# EAGLE design addon-candle-2 (EAGLE 6.6.0)

## Sheet 1 of 4: CAN Transceiver
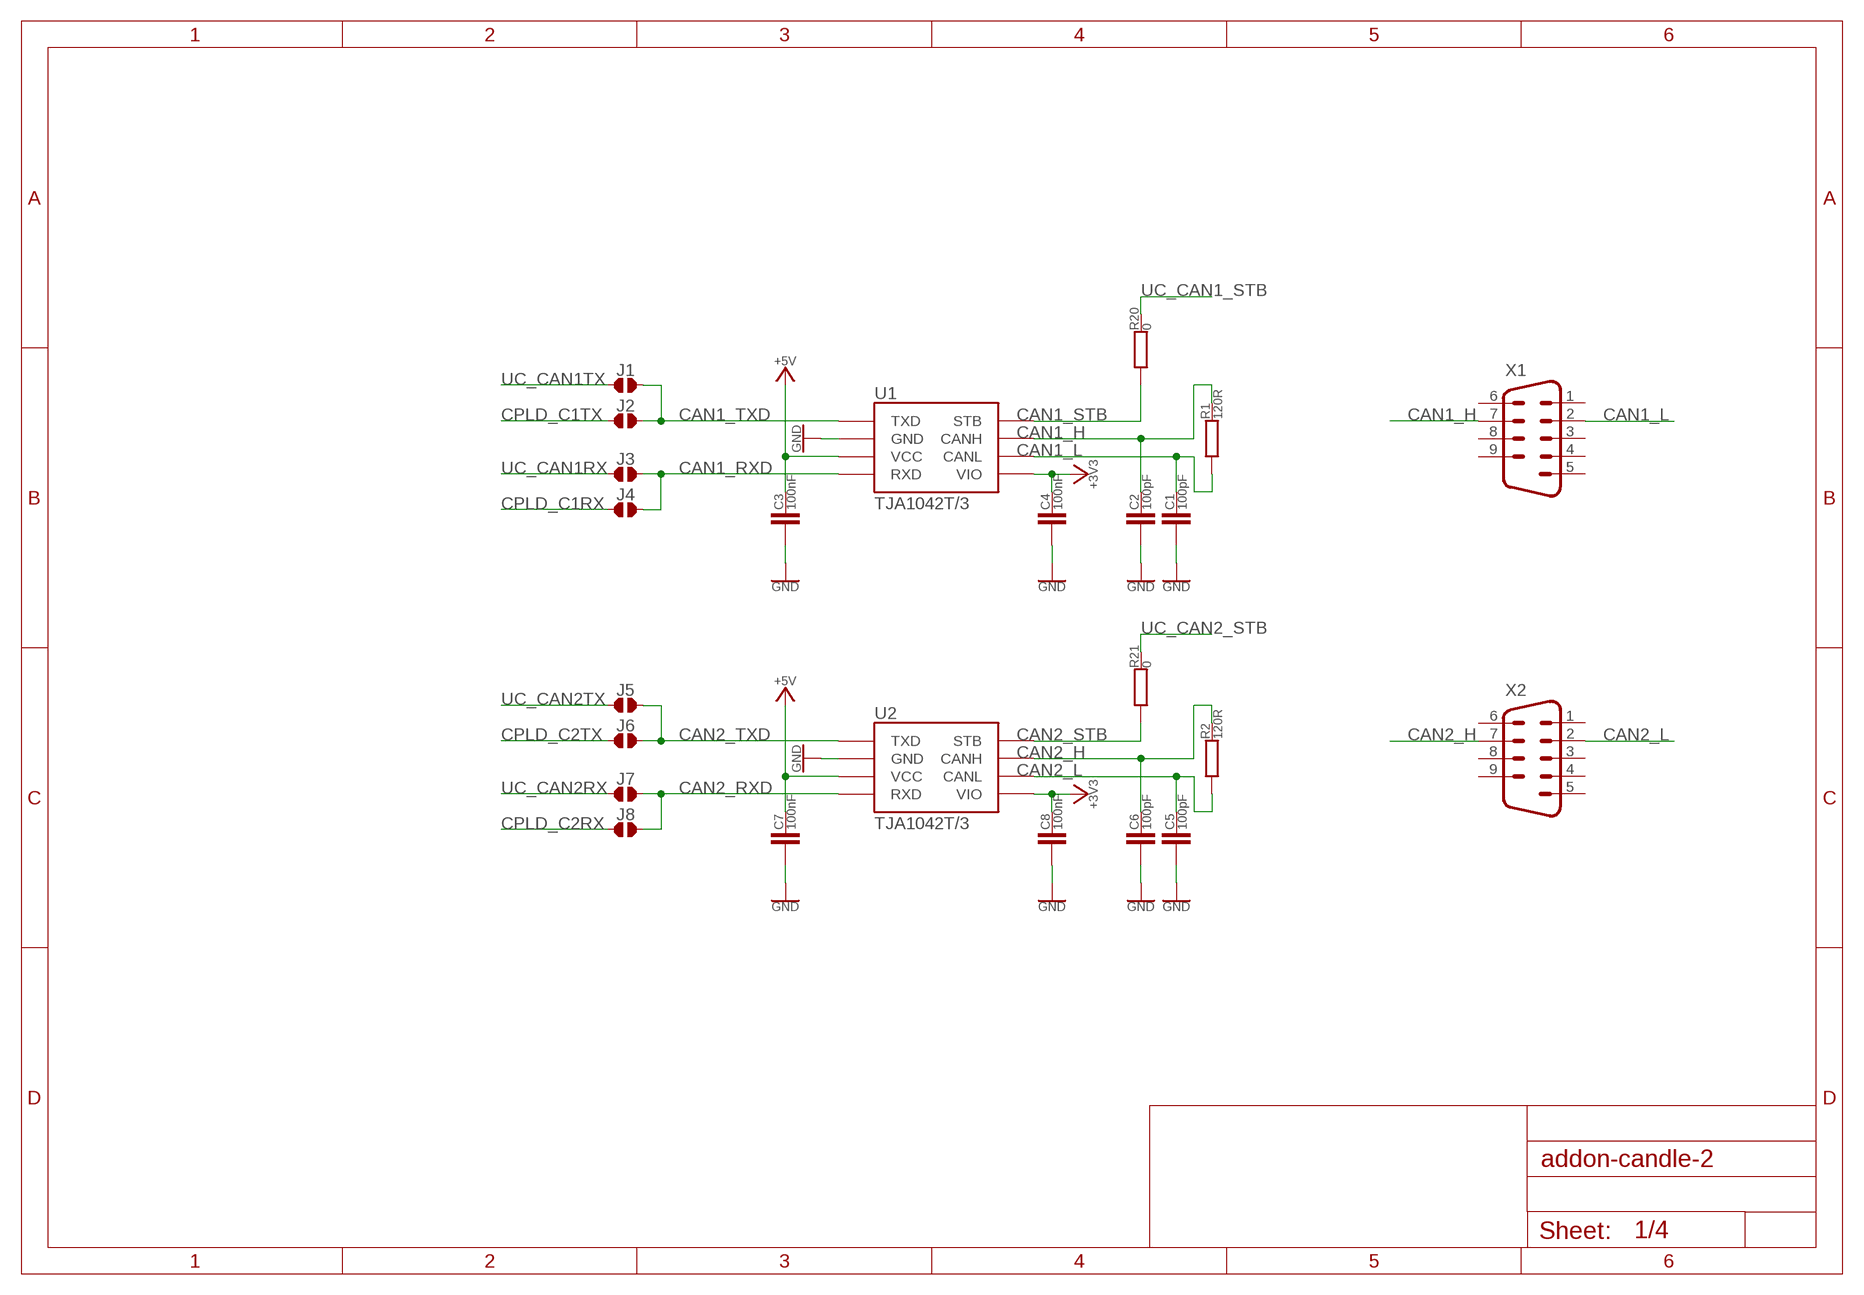
[diagram p0: schematic, sheet 1]

### Parts
C1  100pF  C0603  [C0603]
C2  100pF  C0603  [C0603]
C3  100nF  C0603  [C0603]
C4  100nF  C0603  [C0603]
C5  100pF  C0603  [C0603]
C6  100pF  C0603  [C0603]
C7  100nF  C0603  [C0603]
C8  100nF  C0603  [C0603]
J1  JUMPER-2_10B  [JMP2-1B]
J2  JUMPER-2_10B  [JMP2-1B]
J3  JUMPER-2_10B  [JMP2-1B]
J4  JUMPER-2_10B  [JMP2-1B]
J5  JUMPER-2_10B  [JMP2-1B]
J6  JUMPER-2_10B  [JMP2-1B]
J7  JUMPER-2_10B  [JMP2-1B]
J8  JUMPER-2_10B  [JMP2-1B]
R1  120R  R0603  [R0603]
R2  120R  R0603  [R0603]
R20  0  R0603  [R0603]
R21  0  R0603  [R0603]
U1  TJA1042T/3  [SO08]
U2  TJA1042T/3  [SO08]
X1  M09-182  [182-009-MALE]
X2  M09-182  [182-009-MALE]

### Nets
+3V3: C4.2 C8.2 U1.5(VIO) U2.5(VIO) ; also sheet 2,3,4
+5V: C3.2 C7.2 U1.3(VCC) U2.3(VCC) ; also sheet 2,3
CAN1_H: C2.2 R1.2 U1.7(CANH) X1.7
CAN1_L: C1.2 R1.1 U1.6(CANL) X1.2
CAN1_RXD: J3.1 J4.1 U1.4(RXD)
CAN1_STB: R20.1 U1.8(STB)
CAN1_TXD: J1.1 J2.1 U1.1(TXD)
CAN2_H: C6.2 R2.2 U2.7(CANH) X2.7
CAN2_L: C5.2 R2.1 U2.6(CANL) X2.2
CAN2_RXD: J7.1 J8.1 U2.4(RXD)
CAN2_STB: R21.1 U2.8(STB)
CAN2_TXD: J5.1 J6.1 U2.1(TXD)
CPLD_C1RX: J4.2 ; also sheet 4
CPLD_C1TX: J2.2 ; also sheet 4
CPLD_C2RX: J8.2 ; also sheet 4
CPLD_C2TX: J6.2 ; also sheet 4
GND: C1.1 C2.1 C3.1 C4.1 C5.1 C6.1 C7.1 C8.1 U1.2(GND) U2.2(GND) ; also sheet 2,3,4
UC_CAN1_STB: R20.2 ; also sheet 2
UC_CAN1RX: J3.2 ; also sheet 2,4
UC_CAN1TX: J1.2 ; also sheet 2,4
UC_CAN2_STB: R21.2 ; also sheet 2
UC_CAN2RX: J7.2 ; also sheet 2,4
UC_CAN2TX: J5.2 ; also sheet 2,4
Unconnected: X1.1 X1.3 X1.4 X1.5 X1.6 X1.8 X1.9 X2.1 X2.3 X2.4 X2.5 X2.6 X2.8 X2.9

## Sheet 2 of 4: F4DISCOVERY_HEADER
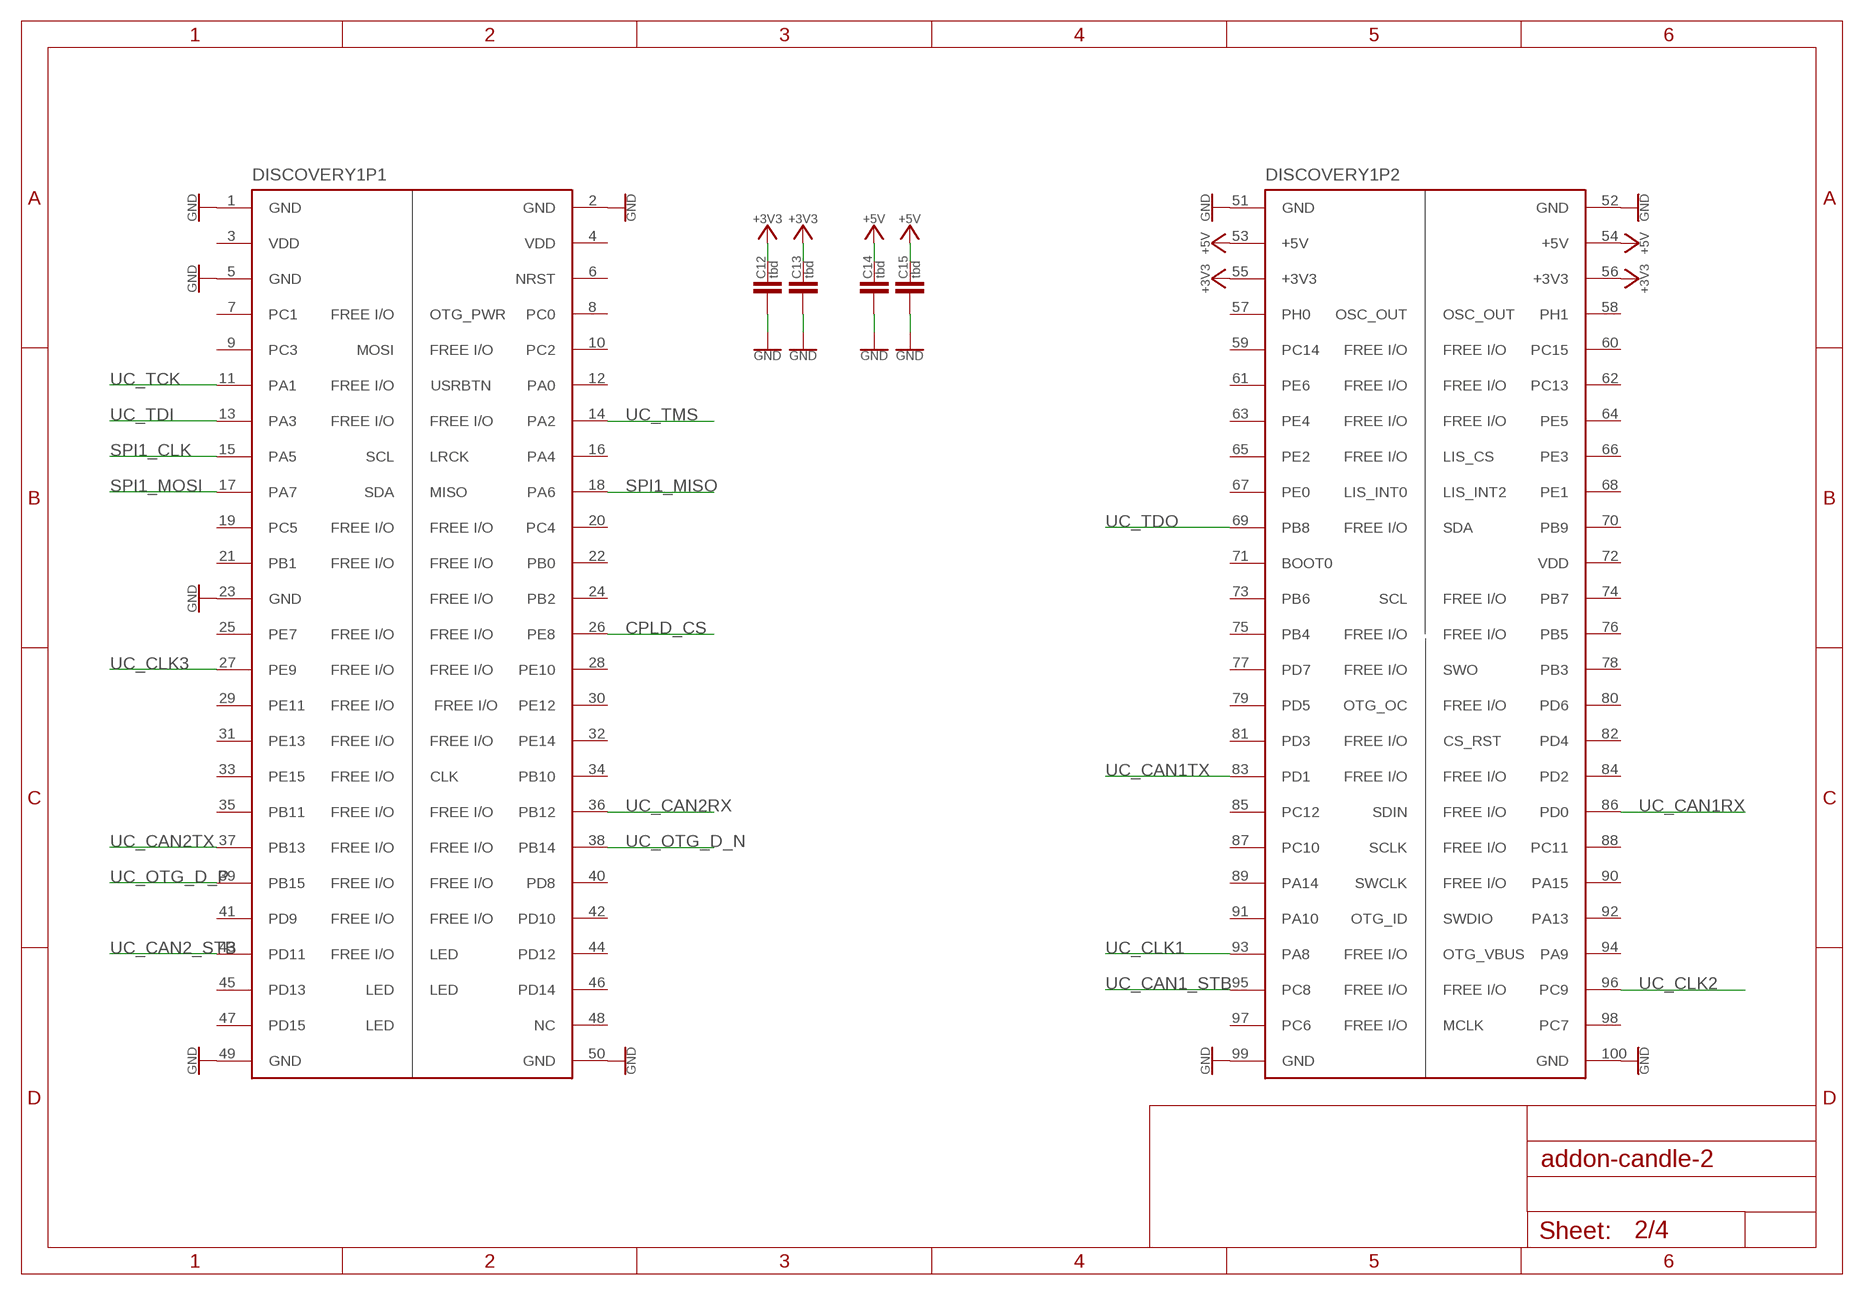
[diagram p1: schematic, sheet 2]

### Parts
C12  tbd  C1206  [C1206]
C13  tbd  C1206  [C1206]
C14  tbd  C1206  [C1206]
C15  tbd  C1206  [C1206]
DISCOVERY1  STM32F4DISCOVERY  [STM32F4DISCOVERY]

### Nets
+3V3: C12.2 C13.2 DISCOVERY1.55(P2:+3V3) DISCOVERY1.56(P2:+3V3) ; also sheet 1,3,4
+5V: C14.2 C15.2 DISCOVERY1.53(P2:+5V) DISCOVERY1.54(P2:+5V) ; also sheet 1,3
CPLD_CS: DISCOVERY1.26(P1:PE8) ; also sheet 4
GND: C12.1 C13.1 C14.1 C15.1 DISCOVERY1.1(P1:GND) DISCOVERY1.2(P1:GND) DISCOVERY1.5(P1:GND) DISCOVERY1.23(P1:GND) DISCOVERY1.49(P1:GND) DISCOVERY1.50(P1:GND) DISCOVERY1.51(P2:GND) DISCOVERY1.52(P2:GND) DISCOVERY1.99(P2:GND) DISCOVERY1.100(P2:GND) ; also sheet 1,3,4
SPI1_CLK: DISCOVERY1.15(P1:PA5) ; also sheet 4
SPI1_MISO: DISCOVERY1.18(P1:PA6) ; also sheet 4
SPI1_MOSI: DISCOVERY1.17(P1:PA7) ; also sheet 4
UC_CAN1_STB: DISCOVERY1.95(P2:PC8) ; also sheet 1
UC_CAN1RX: DISCOVERY1.86(P2:PD0) ; also sheet 1,4
UC_CAN1TX: DISCOVERY1.83(P2:PD1) ; also sheet 1,4
UC_CAN2_STB: DISCOVERY1.43(P1:PD11) ; also sheet 1
UC_CAN2RX: DISCOVERY1.36(P1:PB12) ; also sheet 1,4
UC_CAN2TX: DISCOVERY1.37(P1:PB13) ; also sheet 1,4
UC_CLK1: DISCOVERY1.93(P2:PA8) ; also sheet 4
UC_CLK2: DISCOVERY1.96(P2:PC9) ; also sheet 4
UC_CLK3: DISCOVERY1.27(P1:PE9) ; also sheet 4
UC_OTG_D_N: DISCOVERY1.38(P1:PB14) ; also sheet 3
UC_OTG_D_P: DISCOVERY1.39(P1:PB15) ; also sheet 3
UC_TCK: DISCOVERY1.11(P1:PA1) ; also sheet 4
UC_TDI: DISCOVERY1.13(P1:PA3) ; also sheet 4
UC_TDO: DISCOVERY1.69(P2:PB8) ; also sheet 4
UC_TMS: DISCOVERY1.14(P1:PA2) ; also sheet 4
Unconnected: DISCOVERY1.3(P1:VDD) DISCOVERY1.4(P1:VDD) DISCOVERY1.6(P1:NRST) DISCOVERY1.7(P1:PC1) DISCOVERY1.8(P1:PC0) DISCOVERY1.9(P1:PC3) DISCOVERY1.10(P1:PC2) DISCOVERY1.12(P1:PA0) DISCOVERY1.16(P1:PA4) DISCOVERY1.19(P1:PC5) DISCOVERY1.20(P1:PC4) DISCOVERY1.21(P1:PB1) DISCOVERY1.22(P1:PB0) DISCOVERY1.24(P1:PB2) DISCOVERY1.25(P1:PE7) DISCOVERY1.28(P1:PE10) DISCOVERY1.29(P1:PE11) DISCOVERY1.30(P1:PE12) DISCOVERY1.31(P1:PE13) DISCOVERY1.32(P1:PE14) DISCOVERY1.33(P1:PE15) DISCOVERY1.34(P1:PB10) DISCOVERY1.35(P1:PB11) DISCOVERY1.40(P1:PD8) DISCOVERY1.41(P1:PD9) DISCOVERY1.42(P1:PD10) DISCOVERY1.44(P1:PD12) DISCOVERY1.45(P1:PD13) DISCOVERY1.46(P1:PD14) DISCOVERY1.47(P1:PD15) DISCOVERY1.48(P1:NC) DISCOVERY1.57(P2:PH0) DISCOVERY1.58(P2:PH1) DISCOVERY1.59(P2:PC14) DISCOVERY1.60(P2:PC15) DISCOVERY1.61(P2:PE6) DISCOVERY1.62(P2:PC13) DISCOVERY1.63(P2:PE4) DISCOVERY1.64(P2:PE5) DISCOVERY1.65(P2:PE2) DISCOVERY1.66(P2:PE3) DISCOVERY1.67(P2:PE0) DISCOVERY1.68(P2:PE1) DISCOVERY1.70(P2:PB9) DISCOVERY1.71(P2:BOOT0) DISCOVERY1.72(P2:VDD) DISCOVERY1.73(P2:PB6) DISCOVERY1.74(P2:PB7) DISCOVERY1.75(P2:PB4) DISCOVERY1.76(P2:PB5) DISCOVERY1.77(P2:PD7) DISCOVERY1.78(P2:PB3) DISCOVERY1.79(P2:PD5) DISCOVERY1.80(P2:PD6) DISCOVERY1.81(P2:PD3) DISCOVERY1.82(P2:PD4) DISCOVERY1.84(P2:PD2) DISCOVERY1.85(P2:PC12) DISCOVERY1.87(P2:PC10) DISCOVERY1.88(P2:PC11) DISCOVERY1.89(P2:PA14) DISCOVERY1.90(P2:PA15) DISCOVERY1.91(P2:PA10) DISCOVERY1.92(P2:PA13) DISCOVERY1.94(P2:PA9) DISCOVERY1.97(P2:PC6) DISCOVERY1.98(P2:PC7)

## Sheet 3 of 4: USB Connector
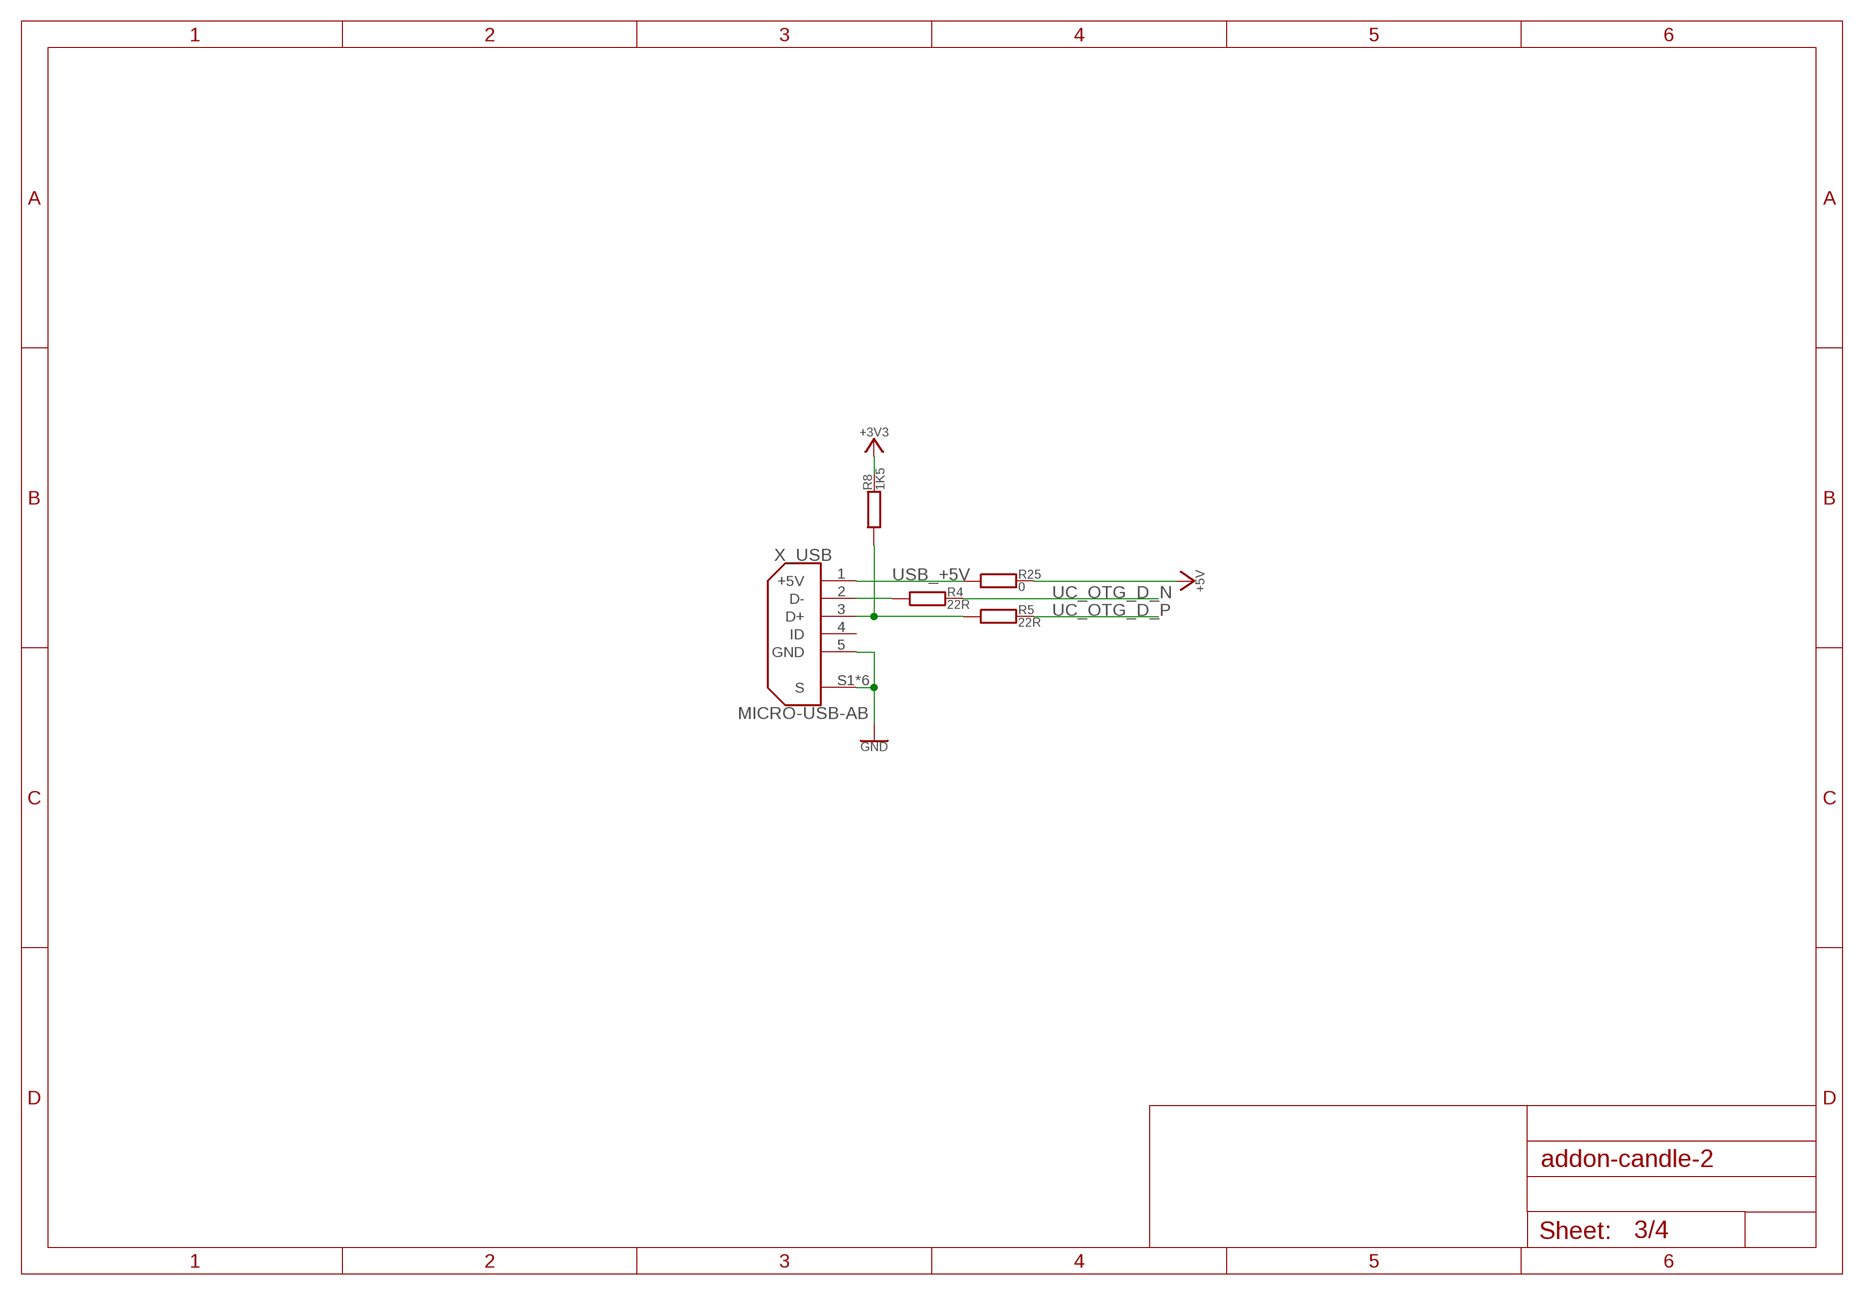
[diagram p2: schematic, sheet 3]

### Parts
R4  22R  R0603  [R0603]
R5  22R  R0603  [R0603]
R8  1K5  R0603  [R0603]
R25  0  R0603  [R0603]
X_USB  MICRO-USB-AB  [ZX62-B-5PA(11)]

### Nets
+3V3: R8.2 ; also sheet 1,2,4
+5V: R25.2 ; also sheet 1,2
GND: X_USB.5(GND) X_USB.S1(S) X_USB.S2(S) X_USB.S3(S) X_USB.S4(S) X_USB.S5(S) X_USB.S6(S) ; also sheet 1,2,4
N$2: R4.1 X_USB.2(D-)
N$3: R5.1 R8.1 X_USB.3(D+)
UC_OTG_D_N: R4.2 ; also sheet 2
UC_OTG_D_P: R5.2 ; also sheet 2
USB_+5V: R25.1 X_USB.1(+5V)
Unconnected: X_USB.4(ID)

## Sheet 4 of 4: CPLD
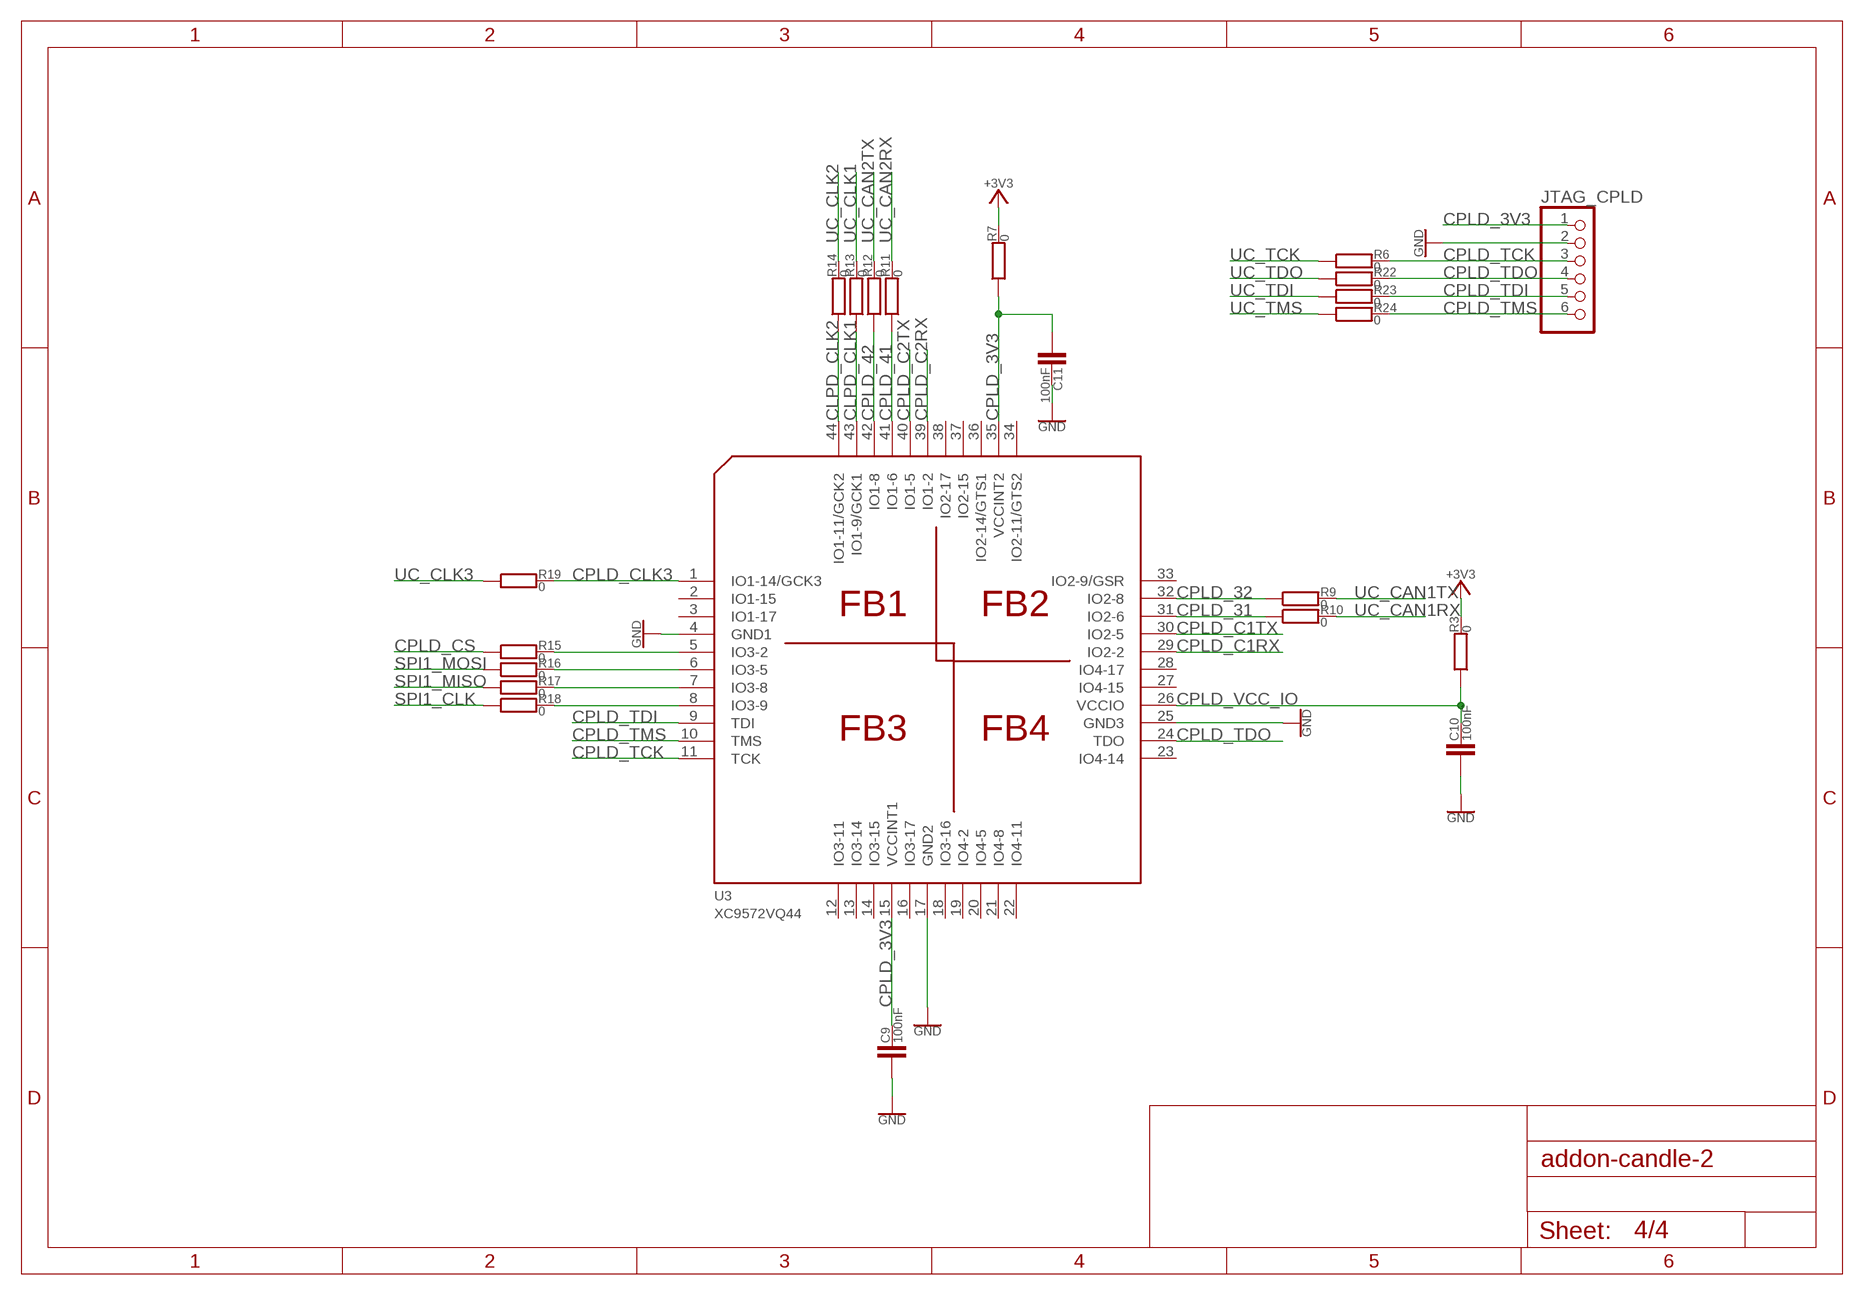
[diagram p3: schematic, sheet 4]

### Parts
C9  100nF  C0603  [C0603]
C10  100nF  C0603  [C0603]
C11  100nF  C0603  [C0603]
JTAG_CPLD  PINHD-1X6  [1X06]
R3  0  R0603  [R0603]
R6  0  R0603  [R0603]
R7  0  R0603  [R0603]
R9  0  R0603  [R0603]
R10  0  R0603  [R0603]
R11  0  R0603  [R0603]
R12  0  R0603  [R0603]
R13  0  R0603  [R0603]
R14  0  R0603  [R0603]
R15  0  R0603  [R0603]
R16  0  R0603  [R0603]
R17  0  R0603  [R0603]
R18  0  R0603  [R0603]
R19  0  R0603  [R0603]
R22  0  R0603  [R0603]
R23  0  R0603  [R0603]
R24  0  R0603  [R0603]
U3  XC9572VQ44  [VQ44]

### Nets
+3V3: R3.2 R7.2 ; also sheet 1,2,3
CLPD_CLK1: R13.1 U3.43(IO1-9/GCK1)
CLPD_CLK2: R14.1 U3.44(IO1-11/GCK2)
CPLD_3V3: C9.2 C11.1 JTAG_CPLD.1 R7.1 U3.15(VCCINT1) U3.35(VCCINT2)
CPLD_31: R10.1 U3.31(IO2-6)
CPLD_32: R9.1 U3.32(IO2-8)
CPLD_41: R11.1 U3.41(IO1-6)
CPLD_42: R12.1 U3.42(IO1-8)
CPLD_C1RX: U3.29(IO2-2) ; also sheet 1
CPLD_C1TX: U3.30(IO2-5) ; also sheet 1
CPLD_C2RX: U3.39(IO1-2) ; also sheet 1
CPLD_C2TX: U3.40(IO1-5) ; also sheet 1
CPLD_CLK3: R19.2 U3.1(IO1-14/GCK3)
CPLD_CS: R15.1 ; also sheet 2
CPLD_TCK: JTAG_CPLD.3 R6.2 U3.11(TCK)
CPLD_TDI: JTAG_CPLD.5 R23.2 U3.9(TDI)
CPLD_TDO: JTAG_CPLD.4 R22.2 U3.24(TDO)
CPLD_TMS: JTAG_CPLD.6 R24.2 U3.10(TMS)
CPLD_VCC_IO: C10.2 R3.1 U3.26(VCCIO)
GND: C9.1 C10.1 C11.2 JTAG_CPLD.2 U3.4(GND1) U3.17(GND2) U3.25(GND3) ; also sheet 1,2,3
N$1: R15.2 U3.5(IO3-2)
N$4: R16.2 U3.6(IO3-5)
N$5: R17.2 U3.7(IO3-8)
N$6: R18.2 U3.8(IO3-9)
SPI1_CLK: R18.1 ; also sheet 2
SPI1_MISO: R17.1 ; also sheet 2
SPI1_MOSI: R16.1 ; also sheet 2
UC_CAN1RX: R10.2 ; also sheet 1,2
UC_CAN1TX: R9.2 ; also sheet 1,2
UC_CAN2RX: R11.2 ; also sheet 1,2
UC_CAN2TX: R12.2 ; also sheet 1,2
UC_CLK1: R13.2 ; also sheet 2
UC_CLK2: R14.2 ; also sheet 2
UC_CLK3: R19.1 ; also sheet 2
UC_TCK: R6.1 ; also sheet 2
UC_TDI: R23.1 ; also sheet 2
UC_TDO: R22.1 ; also sheet 2
UC_TMS: R24.1 ; also sheet 2
Unconnected: U3.2(IO1-15) U3.3(IO1-17) U3.12(IO3-11) U3.13(IO3-14) U3.14(IO3-15) U3.16(IO3-17) U3.18(IO3-16) U3.19(IO4-2) U3.20(IO4-5) U3.21(IO4-8) U3.22(IO4-11) U3.23(IO4-14) U3.27(IO4-15) U3.28(IO4-17) U3.33(IO2-9/GSR) U3.34(IO2-11/GTS2) U3.36(IO2-14/GTS1) U3.37(IO2-15) U3.38(IO2-17)

## Library data of the parts
C1-C15 = bytewerk-passive:C
DISCOVERY1 = stm32f4discovery:STM32F4DISCOVERY
J1-J8 = bytewerk-jumper:JUMPER-2
JTAG_CPLD = pinhead:PINHD-1X6: PIN HEADER
R1-R25 = bytewerk-passive:R
U1 U2 = bytewerk-network:TJA1042T/3
U3 = dp_devices:XC9572
X1 X2 = con-subd:M09: SUB-D; OC_FARNELL: unknown; OC_NEWARK: unknown
X_USB = bytewerk-con:MICRO-USB-AB; MF: HIROSE; MPN: ZX62-AB-5PA(11); OC_MOUSER: 798-ZX62-AB-5PA11

## Board
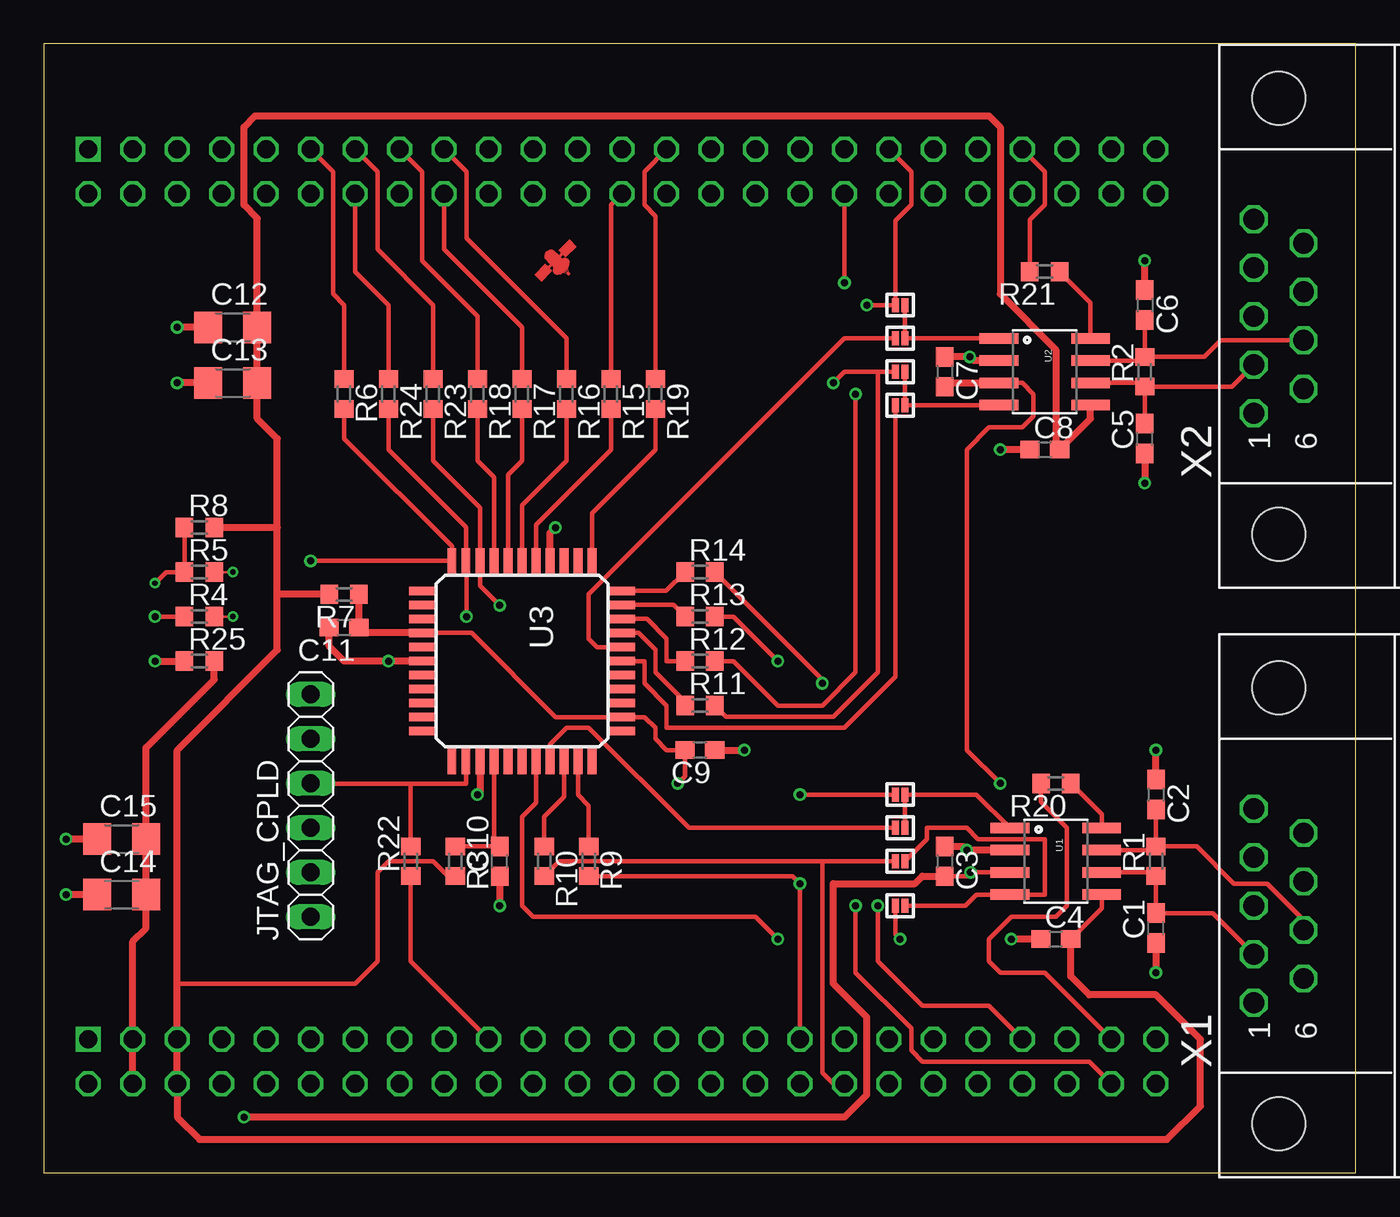
[diagram p4: board, top side]
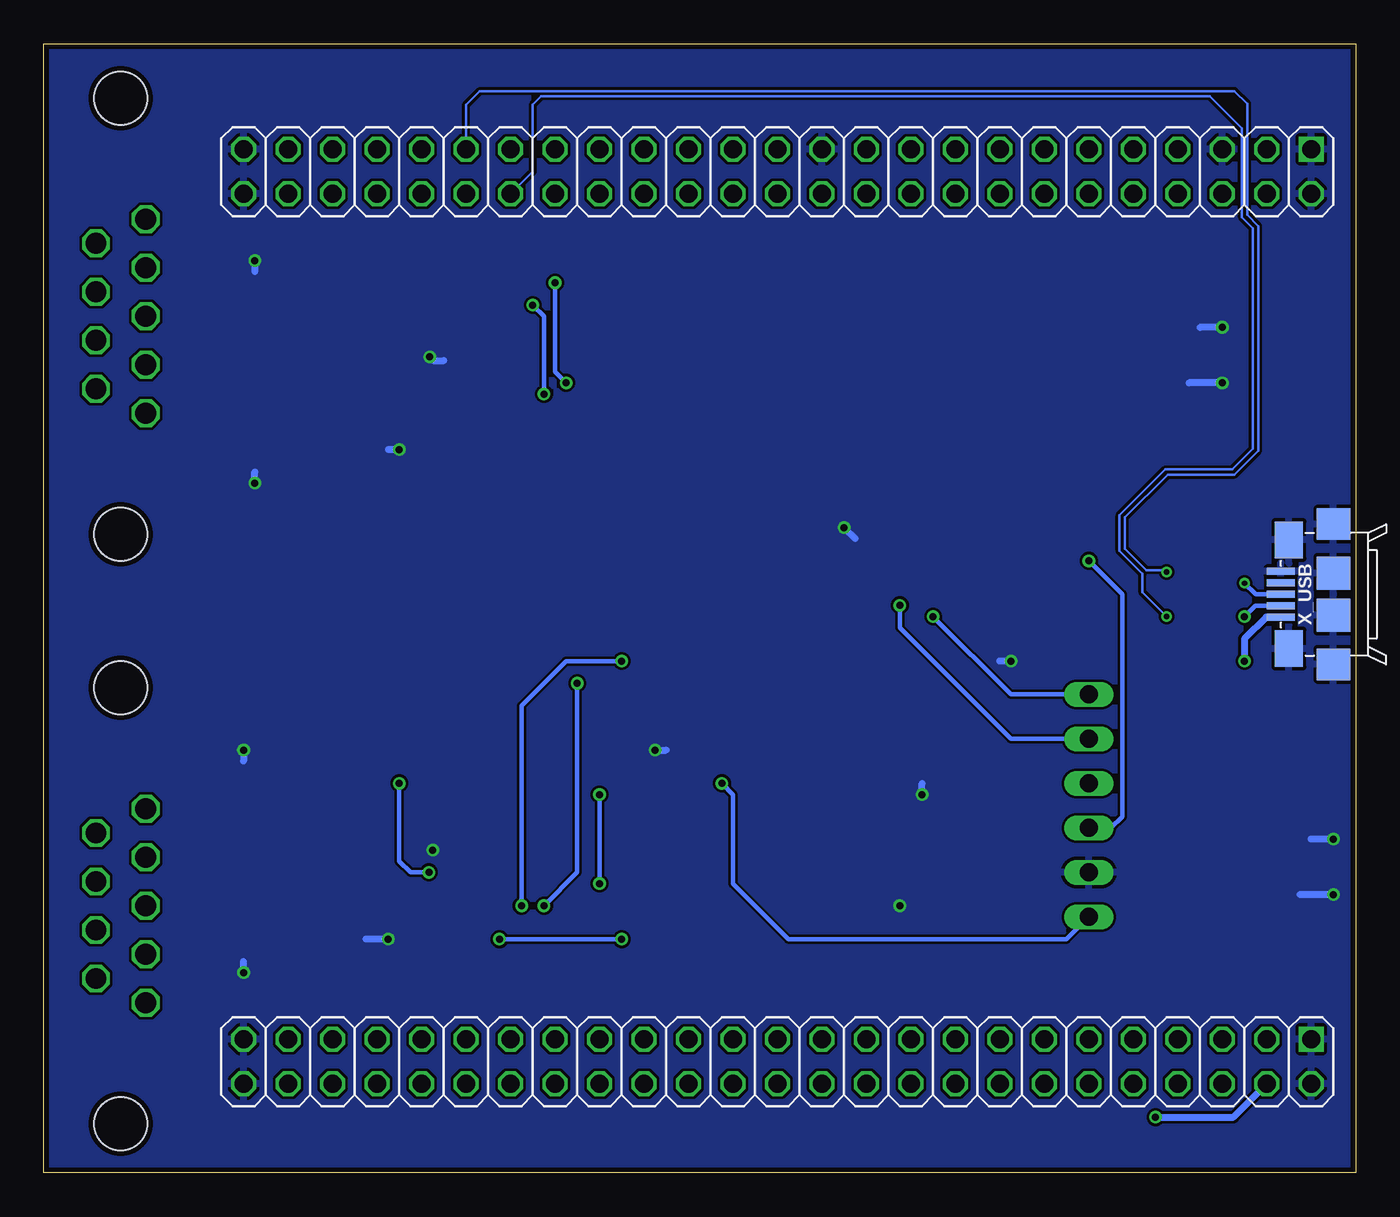
[diagram p5: board, bottom side, seen from below]

Size 74.91 x 64.44 mm. Coordinates in mm from the lower left corner, seen from the top.
Outline: 0,0 74.91,0 74.91,64.44 0,64.44 0,0
Copper layers (1*16): Top 0.035mm / dielectric 1.5mm / Bottom 0.035mm
Design rules "PCB-POOL Standard": minimum track width 0.15mm, minimum drill 0.3mm, track to track 0.15mm, track to pad 0.15mm, pad to pad 0.15mm, via to via 0.15mm, smd to smd 0.15mm, copper to edge 0.3mm, drill to drill 0.2mm, minimum pad ring 0.2mm, minimum via ring 0.15mm, stop-mask expansion 0.075mm, vias tented up to drill 0mil, thermal gap 0.2mm

### Footprints (pad centres in the part's own frame; a part is rotated, then mirrored left to right if it is on the bottom)
C0603 = smd 1.1 x 1: 1 -0.85,0; 2 0.85,0
C1206 = smd 1.6 x 1.8: 1 -1.4,0; 2 1.4,0
STM32F4DISCOVERY = drill 1.016 square: 1 -25.4,30.48; 51 25.4,30.48 | drill 1.016 octagon: 2 -22.86,30.48; 3 -25.4,27.94; 4 -22.86,27.94; 5 -25.4,25.4; 6 -22.86,25.4; 7 -25.4,22.86; 8 -22.86,22.86; 9 -25.4,20.32; 10 -22.86,20.32; 11 -25.4,17.78; 12 -22.86,17.78; 13 -25.4,15.24; 14 -22.86,15.24; 15 -25.4,12.7; 16 -22.86,12.7; 17 -25.4,10.16; 18 -22.86,10.16; 19 -25.4,7.62; 20 -22.86,7.62; 21 -25.4,5.08; 22 -22.86,5.08; 23 -25.4,2.54; 24 -22.86,2.54; 25 -25.4,0; 26 -22.86,0; 27 -25.4,-2.54; 28 -22.86,-2.54; 29 -25.4,-5.08; 30 -22.86,-5.08; 31 -25.4,-7.62; 32 -22.86,-7.62; 33 -25.4,-10.16; 34 -22.86,-10.16; 35 -25.4,-12.7; 36 -22.86,-12.7; 37 -25.4,-15.24; 38 -22.86,-15.24; 39 -25.4,-17.78; 40 -22.86,-17.78; 41 -25.4,-20.32; 42 -22.86,-20.32; 43 -25.4,-22.86; 44 -22.86,-22.86; 45 -25.4,-25.4; 46 -22.86,-25.4; 47 -25.4,-27.94; 48 -22.86,-27.94; 49 -25.4,-30.48; 50 -22.86,-30.48; 52 27.94,30.48; 53 25.4,27.94; 54 27.94,27.94; 55 25.4,25.4; 56 27.94,25.4; 57 25.4,22.86; 58 27.94,22.86; 59 25.4,20.32; 60 27.94,20.32; 61 25.4,17.78; 62 27.94,17.78; 63 25.4,15.24; 64 27.94,15.24; 65 25.4,12.7; 66 27.94,12.7; 67 25.4,10.16; 68 27.94,10.16; 69 25.4,7.62; 70 27.94,7.62; 71 25.4,5.08; 72 27.94,5.08; 73 25.4,2.54; 74 27.94,2.54; 75 25.4,0; 76 27.94,0; 77 25.4,-2.54; 78 27.94,-2.54; 79 25.4,-5.08; 80 27.94,-5.08; 81 25.4,-7.62; 82 27.94,-7.62; 83 25.4,-10.16; 84 27.94,-10.16; 85 25.4,-12.7; 86 27.94,-12.7; 87 25.4,-15.24; 88 27.94,-15.24; 89 25.4,-17.78; 90 27.94,-17.78; 91 27.94,-20.32; 92 25.4,-20.32; 93 25.4,-22.86; 94 25.4,-25.4; 95 25.4,-27.94; 96 27.94,-27.94; 97 27.94,-25.4; 98 27.94,-22.86; 99 27.94,-30.48; 100 25.4,-30.48
JMP2-1B = smd 0.4 x 0.8: 1 0.275,0; 2 -0.275,0
1X06 = drill 1.016 long: 1 -6.35,0; 2 -3.81,0; 3 -1.27,0; 4 1.27,0; 5 3.81,0; 6 6.35,0
R0603 = smd 1 x 1.1: 1 -0.85,0; 2 0.85,0
SO08 = smd 0.61 x 2.21: 1 -1.905,-2.616; 2 -0.635,-2.616; 3 0.635,-2.616; 4 1.905,-2.616; 5 1.905,2.616; 6 0.635,2.616; 7 -0.635,2.616; 8 -1.905,2.616
VQ44 = smd 1.5 x 0.5: 1 -5.7,4; 2 -5.7,3.2; 3 -5.7,2.4; 4 -5.7,1.6; 5 -5.7,0.8; 6 -5.7,0; 7 -5.7,-0.8; 8 -5.7,-1.6; 9 -5.7,-2.4; 10 -5.7,-3.2; 11 -5.7,-4; 23 5.7,-4; 24 5.7,-3.2; 25 5.7,-2.4; 26 5.7,-1.6; 27 5.7,-0.8; 28 5.7,0; 29 5.7,0.8; 30 5.7,1.6; 31 5.7,2.4; 32 5.7,3.2; 33 5.7,4 | smd 0.5 x 1.5: 12 -4,-5.7; 13 -3.2,-5.7; 14 -2.4,-5.7; 15 -1.6,-5.7; 16 -0.8,-5.7; 17 0,-5.7; 18 0.8,-5.7; 19 1.6,-5.7; 20 2.4,-5.7; 21 3.2,-5.7; 22 4,-5.7; 34 4,5.7; 35 3.2,5.7; 36 2.4,5.7; 37 1.6,5.7; 38 0.8,5.7; 39 0,5.7; 40 -0.8,5.7; 41 -1.6,5.7; 42 -2.4,5.7; 43 -3.2,5.7; 44 -4,5.7
182-009-MALE = drill 1.194 pad 1.524 octagon: 1 -5.537,10.923; 2 -2.769,10.923; 3 0,10.923; 4 2.769,10.923; 5 5.537,10.923; 6 -4.153,8.08; 7 -1.384,8.08; 8 1.384,8.08; 9 4.153,8.08 | hole 3.048: -12.446,9.501; 12.446,9.501
ZX62-B-5PA(11) = smd 0.4 x 1.6: 1 -1.3,3; 2 -0.65,3; 3 0,3; 4 0.65,3; 5 1.3,3 | smd 2.1 x 1.6: S1 -3.1,2.55; S2 3.1,2.55 | smd 1.8 x 1.9: S3 -4,0; S4 4,0 | smd 1.9 x 1.9: S5 -1.2,0; S6 1.2,0

### Placement (x,y rotation side)
C1  63.5,13.97 90 top
C2  63.5,21.59 270 top
C3  51.44,17.78 270 top
C4  57.78,13.34 0 top
C5  62.87,41.91 90 top
C6  62.87,49.53 270 top
C7  51.44,45.72 270 top
C8  57.15,41.27 0 top
C9  37.47,24.13 180 top
C10  26.04,17.78 90 top
C11  17.14,31.11 180 top
C12  10.79,48.26 0 top
C13  10.79,45.09 0 top
C14  4.45,15.88 0 top
C15  4.45,19.05 0 top
DISCOVERY1  33.02,33.02 270 bottom
J1  48.9,21.59 0 top
J2  48.9,19.68 0 top
J3  48.9,17.78 0 top
J4  48.9,15.24 0 top
J5  48.9,49.53 0 top
J6  48.9,47.62 0 top
J7  48.9,45.72 0 top
J8  48.9,43.81 0 top
JTAG_CPLD  15.24,20.95 90 top
R1  63.5,17.78 90 top
R2  62.87,45.72 90 top
R3  23.5,17.78 270 top
R4  8.89,31.75 0 top
R5  8.89,34.29 0 top
R6  17.14,44.45 270 top
R7  17.14,33.02 180 top
R8  8.89,36.83 0 top
R9  31.11,17.78 270 top
R10  28.57,17.78 270 top
R11  37.47,26.67 0 top
R12  37.47,29.21 0 top
R13  37.47,31.75 0 top
R14  37.47,34.29 0 top
R15  32.38,44.45 270 top
R16  29.84,44.45 270 top
R17  27.3,44.45 270 top
R18  24.77,44.45 270 top
R19  34.92,44.45 270 top
R20  57.78,22.23 180 top
R21  57.15,51.44 180 top
R22  20.95,17.78 90 top
R23  22.23,44.45 270 top
R24  19.68,44.45 270 top
R25  8.89,29.21 0 top
U1  57.78,17.78 270 top
U2  57.15,45.72 270 top
U3  27.3,29.21 270 top
U$18  [BYTEWERK-LOGO]  29.21,52.07 0 top
X1  80.01,15.24 90 top
X2  80.01,48.9 90 top
X_USB  1.27,33.02 90 bottom

### Tracks (layer width: path | path; a pad name or v marks a point on that pad's centre or on a via)
+3V3
  Top 0.25: R3.2 23.07,16.93 22.23,17.78 19.68,17.78 19.05,17.14 19.05,12.06 17.78,10.79 7.62,10.79 | C4.2 60.4,15.1 U1.5
  Top 0.405: DISCOVERY1.56 7.62,3.17 8.89,1.91 64.14,1.91 66.04,3.81 66.04,7.62 63.5,10.16 59.69,10.16 58.63,11.21 C4.2 | 13.34,36.83 13.34,41.91 12.2,43.05 C13.2
  Top 0.406: DISCOVERY1.56 DISCOVERY1.55 7.62,10.79 7.62,24.13 13.34,29.84 13.34,33.02 | R8.2 13.34,36.83 13.34,33.02 | 12.06,44.95 C13.2 C12.2 12.2,54.48 11.43,55.24 11.43,59.69 12.06,60.33 53.98,60.33 54.61,59.69 54.61,50.16 57.78,46.99 57.78,41.49 C8.2 59.77,43.04 U2.5 | R7.2 13.34,33.02
+5V  (via drill 0.4)
  Top 0.25: U1.3 v52.92,17.14 52.7,16.93 C3.2 | v54.61,22.23 52.7,24.13 52.7,41.27 53.98,42.55 55.88,42.55 56.52,43.18 56.52,44.45 55.88,45.09 U2.3
  Top 0.405: v11.43,3.17 45.72,3.17 46.99,4.45 46.99,8.89 45.09,10.79 45.09,16.51 49.74,16.51 50.16,16.93 C3.2
  Top 0.406: DISCOVERY1.54 DISCOVERY1.53 5.08,13.21 5.84,13.97 5.84,15.37 | 5.71,15.24 5.84,15.37 | 5.84,15.37 C14.2 C15.2 5.84,24.26 9.74,28.16 R25.2 | C7.2 51.65,45.09 U2.3
  Bottom 0.25: v52.92,17.14 53.98,17.14 54.61,17.78 v54.61,22.23
  Bottom 0.405: v11.43,3.17 6.99,3.17 DISCOVERY1.54
CAN1_H
  Top 0.25: U1.7 63.28,18.41 R1.2 | R1.2 65.83,18.63 67.94,16.51 69.85,16.51 71.75,14.61 71.75,14.03 X1.7 | R1.2 C2.2
CAN1_L
  Top 0.25: U1.6 63.28,17.14 R1.1 C1.2 66.74,14.82 X1.2
CAN1_RXD
  Top 0.25: J4.1 52.63,15.24 53.26,15.88 U1.4 57.15,15.88 57.15,19.05 53.34,19.05 52.7,19.68 50.44,19.68 50.44,19.05 J3.1
CAN1_STB
  Top 0.25: R20.1 60.4,20.46 U1.8
CAN1_TXD
  Top 0.25: J2.1 J1.1 53.26,21.59 U1.1
CAN2_H
  Top 0.25: U2.7 62.65,46.35 R2.2 | R2.2 C6.2 | X2.7 67.2,47.51 66.25,46.57 R2.2
CAN2_L
  Top 0.25: U2.6 62.65,45.09 R2.1 | R2.1 C5.2 | R2.1 67.83,44.87 X2.2
CAN2_RXD
  Top 0.25: U2.4 J8.1 J7.1
CAN2_STB
  Top 0.25: U2.8 59.77,49.67 R21.1
CAN2_TXD
  Top 0.25: U2.1 J6.1 J5.1
CLPD_CLK1
  Top 0.25: U3.43 35.95,32.41 R13.1
CLPD_CLK2
  Top 0.25: U3.44 35.53,33.21 R14.1
CPLD_3V3  (via drill 0.4)
  Top 0.25: U3.15 24.43,30.81 29.23,26.01 U3.35 34.31,26.01 34.92,25.4 34.92,24.77 35.56,24.13 C9.2 36.62,22.64 v36.2,22.23
  Top 0.406: U3.15 18.3,30.81 C11.1 R7.1
  Bottom 0.25: v36.2,22.23 35.56,21.59 35.56,16.51 32.38,13.34 16.51,13.34 JTAG_CPLD.1
CPLD_31
  Top 0.25: R10.1 28.57,20.32 29.7,21.45 U3.31
CPLD_32
  Top 0.25: R9.1 31.11,20.95 30.5,21.57 U3.32
CPLD_41
  Top 0.25: U3.41 33.96,30.81 34.92,29.84 34.92,28.57 36.62,26.89 R11.1
CPLD_42
  Top 0.25: U3.42 34.43,31.61 35.56,30.48 35.56,29.21 R12.1
CPLD_C1RX  (via drill 0.4)
  Top 0.25: U3.29 28.11,21.12 27.3,20.32 27.3,15.24 27.94,14.61 40.64,14.61 v41.91,13.34 | v48.9,13.34 48.62,13.61 J4.2
  Bottom 0.25: v41.91,13.34 v48.9,13.34
CPLD_C1TX
  Top 0.25: J2.2 36.83,19.68 31.11,25.4 29.84,25.4 28.91,24.46 U3.30
CPLD_C2RX
  Top 0.25: J8.2 48.62,28.3 45.72,25.4 35.56,25.4 35.56,26.67 34.29,27.94 34.29,29.21 U3.39
CPLD_C2TX
  Top 0.25: U3.40 31.59,30.01 31.11,30.48 31.11,33.02 45.72,47.62 J6.2
CPLD_CLK3
  Top 0.25: U3.1 31.3,37.66 34.92,41.27 R19.2
CPLD_CS
  Top 0.25: R15.1 32.38,55.24 DISCOVERY1.26
CPLD_TCK  (via drill 0.4)
  Top 0.25: R6.2 17.14,41.91 23.3,35.75 U3.11 23.29,34.92 v15.24,34.92
  Bottom 0.25: JTAG_CPLD.3 13.97,19.68 13.34,20.32 13.34,33.02 v15.24,34.92
CPLD_TDI  (via drill 0.4)
  Top 0.25: R23.2 22.23,40.64 24.91,37.96 U3.9 24.91,33.52 v26.04,32.38
  Bottom 0.25: JTAG_CPLD.5 19.68,24.77 26.04,31.11 v26.04,32.38
CPLD_TDO
  Top 0.25: U3.24 24.11,22.2 20.95,22.2 | 20.95,22.2 15.27,22.2 JTAG_CPLD.4 | R22.2 20.95,22.2
CPLD_TMS  (via drill 0.4)
  Top 0.25: R24.2 19.68,41.27 24.11,36.85 U3.10 24.13,34.88 v24.13,31.75
  Bottom 0.25: JTAG_CPLD.6 19.68,27.3 v24.13,31.75
CPLD_VCC_IO
  Top 0.25: R3.1 C10.2 | U3.26 25.7,18.96
  Top 0.406: 25.7,18.96 C10.2
GND  (via drill 0.4)
  Top 0.406: C15.1 v1.27,19.05 | C14.1 v1.27,15.88 | C12.1 v7.62,48.26 | C13.1 v7.62,45.09 | U3.17 v19.68,29.21 17.14,29.21 16.3,30.06 C11.2 | U3.25 24.91,21.73 v24.77,21.59 | C10.1 v26.04,15.24 | C9.1 v40.01,24.13 | U3.4 28.91,36.52 v29.21,36.83 | C1.1 v63.5,11.43 | C4.1 v55.24,13.34 | C3.1 52.49,18.63 v52.7,18.41 U1.2 | C2.1 v63.5,24.13 | C5.1 v62.87,39.37 | C6.1 v62.87,52.07 | C7.1 v52.88,46.57 53.09,46.35 U2.2 | C8.1 v54.61,41.27
  Bottom 0.406: v1.27,19.05 2.54,19.05 | v1.27,15.88 3.17,15.88 | v7.62,48.26 8.89,48.26 | v7.62,45.09 9.53,45.09 | v19.68,29.21 20.32,29.21 | v24.77,21.59 24.77,22.23 | v40.01,24.13 39.37,24.13 | v29.21,36.83 28.57,36.2 | v63.5,11.43 63.5,12.06 | v55.24,13.34 56.52,13.34 | v63.5,24.13 63.5,23.5 | v62.87,39.37 62.87,40.01 | v62.87,52.07 62.87,51.44 | v52.88,46.57 52.66,46.35 52.07,46.35 | v54.61,41.27 55.24,41.27
  pour Bottom: -0.64,65.41 76.2,65.41 76.2,-2.54 -0.64,-2.54
N$1
  Top 0.25: U3.5 28.11,36.99 32.38,41.27 R15.2
N$2  (via drill 0.4)
  Top 0.25: v6.35,31.75 R4.1
  Bottom 0.25: X_USB.2 5.73,32.37 v6.35,31.75
N$3  (via drill 0.3)
  Top 0.25: R5.1 R8.1 | 8.04,34.08 R5.1 | v6.35,33.66 6.99,34.29 R5.1
  Bottom 0.25: X_USB.3 5.71,33.02 v6.35,33.66
N$4
  Top 0.25: U3.6 27.3,38.1 29.84,40.64 R16.2
N$5
  Top 0.25: U3.7 26.5,39.84 27.3,40.64 R17.2
N$6
  Top 0.25: U3.8 25.7,39.7 24.77,40.64 R18.2
SPI1_CLK
  Top 0.25: R18.1 24.77,48.9 21.59,52.07 21.59,57.15 DISCOVERY1.15
SPI1_MISO
  Top 0.25: R17.1 27.3,48.26 22.86,52.7 DISCOVERY1.18
SPI1_MOSI
  Top 0.25: R16.1 29.84,47.62 24.13,53.34 24.13,57.15 DISCOVERY1.17
UC_CAN1_STB
  Top 0.25: DISCOVERY1.95 57.15,11.43 54.61,11.43 53.98,12.06 53.98,13.34 55.24,14.61 57.78,14.61 58.42,15.24 58.42,19.68 56.94,21.17 R20.2
UC_CAN1RX
  Top 0.25: R10.2 29.43,17.78 44.45,17.78 | 44.45,17.78 J3.2 | DISCOVERY1.86 45.09,5.08 44.45,5.71 44.45,17.78
UC_CAN1TX  (via drill 0.4)
  Top 0.25: R9.2 42.76,16.93 v43.18,16.51 DISCOVERY1.83 | v43.18,21.59 J1.2
  Bottom 0.25: v43.18,16.51 v43.18,21.59
UC_CAN2_STB
  Top 0.25: R21.2 56.3,54.4 57.15,55.24 57.15,57.15 DISCOVERY1.43
UC_CAN2RX  (via drill 0.4)
  Top 0.25: J7.2 47.62,45.72 | v45.72,50.8 DISCOVERY1.36 | R11.2 38.95,26.04 45.09,26.04 47.62,28.57 47.62,45.72 | 47.62,45.72 45.72,45.72 v45.09,45.09
  Bottom 0.25: v45.09,45.09 45.72,45.72 v45.72,50.8
UC_CAN2TX  (via drill 0.4)
  Top 0.25: DISCOVERY1.37 49.53,57.15 49.53,55.24 48.62,54.34 J5.2 v46.99,49.53 | R12.2 39.37,29.21 41.91,26.67 44.45,26.67 46.35,28.57 v46.35,44.45
  Bottom 0.25: v46.35,44.45 46.35,48.9 v46.99,49.53
UC_CLK1  (via drill 0.4)
  Top 0.25: DISCOVERY1.93 53.98,9.53 50.16,9.53 47.62,12.06 v47.62,15.24 | v41.91,29.21 39.37,31.75 R13.2
  Bottom 0.25: v47.62,15.24 47.62,26.67 45.09,29.21 v41.91,29.21
UC_CLK2  (via drill 0.4)
  Top 0.25: DISCOVERY1.96 59.69,6.35 50.16,6.35 49.53,6.99 49.53,8.26 46.35,11.43 v46.35,15.24 | v44.45,27.94 44.45,28.16 R14.2
  Bottom 0.25: v46.35,15.24 44.45,17.14 v44.45,27.94
UC_CLK3
  Top 0.25: R19.1 34.92,54.61 34.29,55.24 34.29,57.15 DISCOVERY1.27
UC_OTG_D_N  (via drill 0.3)
  Top 0.15: R4.2 v10.79,31.75
  Bottom 0.15: v10.79,31.75 12.17,33.13 12.17,34.18 13.48,35.5 13.48,37.53 10.86,40.16 7.05,40.16 5.87,41.34 5.87,53.91 6.5,54.55 6.5,59.63 8.32,61.45 46.51,61.45 46.99,60.96 46.99,57.15 DISCOVERY1.38
UC_OTG_D_P  (via drill 0.3)
  Top 0.15: R5.2 v10.79,34.29
  Bottom 0.15: v10.79,34.29 10.9,34.4 11.96,34.4 13.19,35.62 13.19,37.4 10.73,39.85 6.92,39.85 5.57,41.21 5.57,54.04 6.2,54.67 6.2,61.02 6.92,61.74 50.02,61.74 50.8,60.96 DISCOVERY1.39
UC_TCK
  Top 0.25: R6.1 17.14,49.53 16.51,50.16 16.51,57.15 DISCOVERY1.11
UC_TDI
  Top 0.25: R23.1 22.23,49.53 19.05,52.7 19.05,57.15 DISCOVERY1.13
UC_TDO
  Top 0.25: DISCOVERY1.69 20.95,12.06 R22.1
UC_TMS
  Top 0.25: R24.1 19.68,49.53 17.78,51.44 DISCOVERY1.14
USB_+5V  (via drill 0.4)
  Top 0.406: v6.35,29.21 R25.1
  Bottom 0.406: X_USB.1 5.11,31.72 6.35,30.48 v6.35,29.21